# Altium schematic sheet 4 SFP.SchDoc
size 594 x 420 mm; SheetNumber: 5; SheetTotal: 9
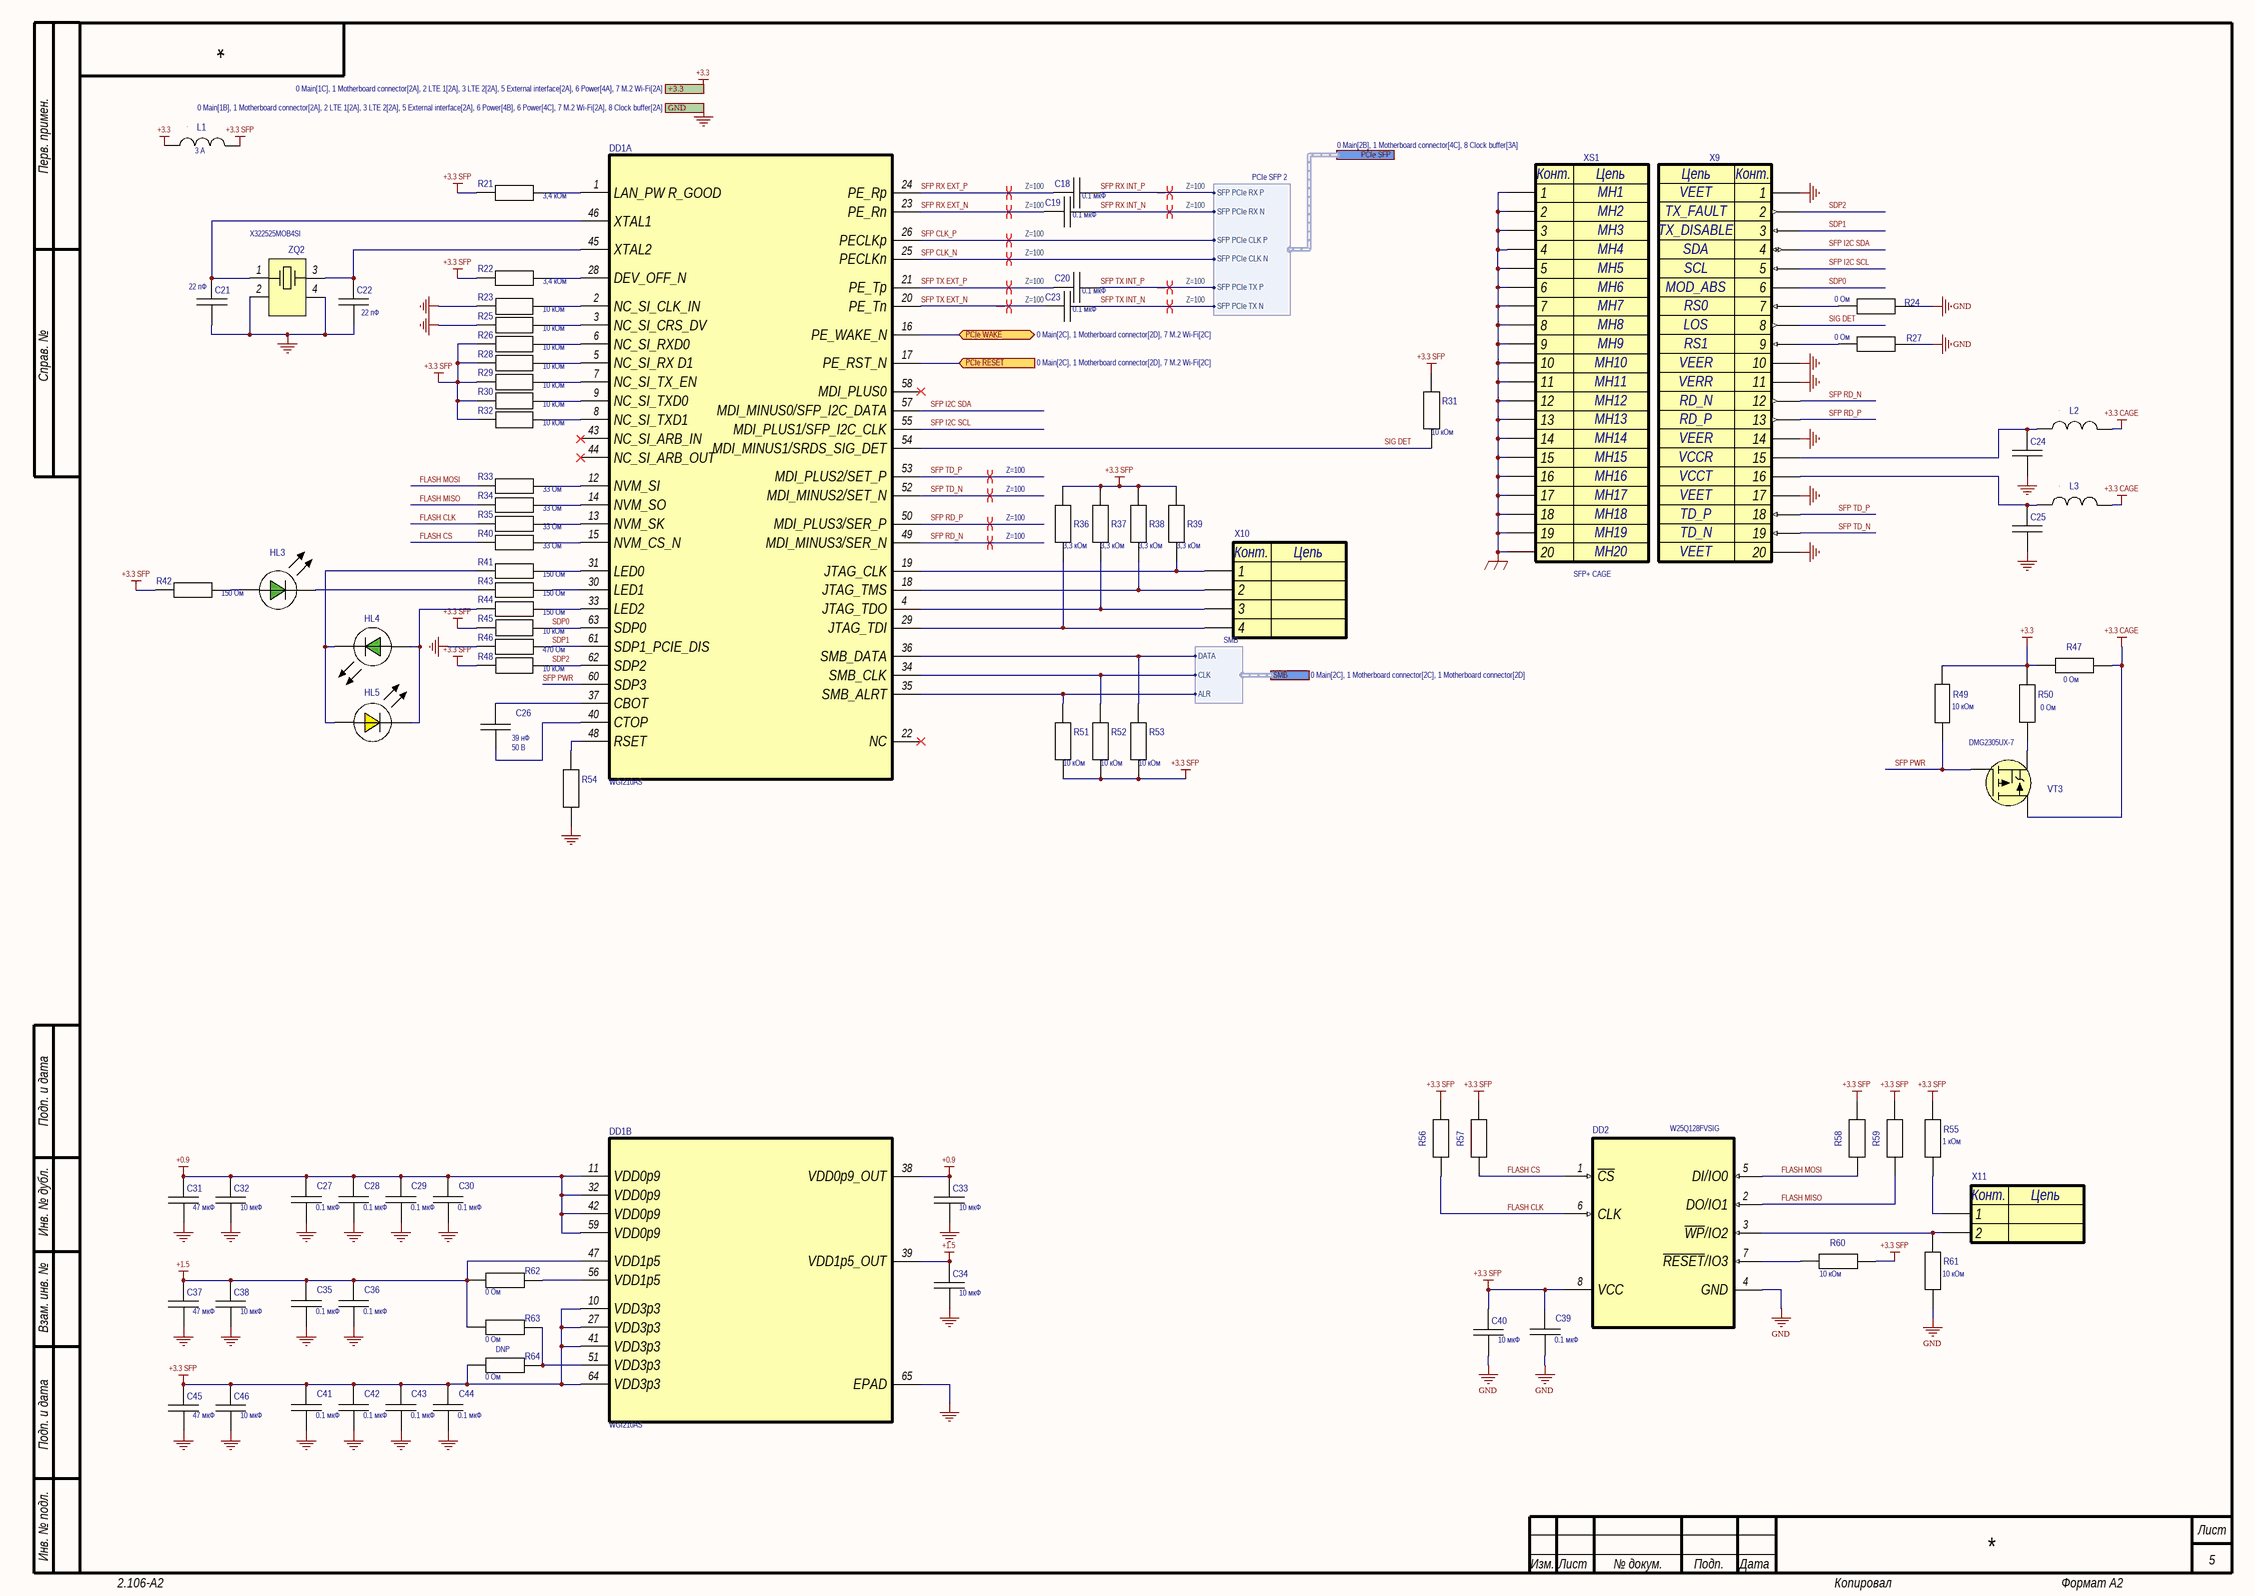
[diagram p0: 4 SFP.SchDoc]

## Parts
C18  value 0.1 мкФ  [CAP_0402]
C19  value 0.1 мкФ  [CAP_0402]
C20  value 0.1 мкФ  [CAP_0402]
C21  value 22 пФ  [CAP_0402]
C22  value 22 пФ  [CAP_0402]
C23  value 0.1 мкФ  [CAP_0402]
C24  (no value)  [CAP_0805]
C25  (no value)  [CAP_0805]
C26  value 39 нФ  Напряжение: 50 В  [CAP_0603]
C27  value 0.1 мкФ  [CAP_0402]
C28  value 0.1 мкФ  [CAP_0402]
C29  value 0.1 мкФ  [CAP_0402]
C30  value 0.1 мкФ  [CAP_0402]
C31  value 47 мкФ  [CAP_0805]
C32  value 10 мкФ  [CAP_0402_BIG]
C33  value 10 мкФ  [CAP_0402_BIG]
C34  value 10 мкФ  [CAP_0402_BIG]
C35  value 0.1 мкФ  [CAP_0402]
C36  value 0.1 мкФ  [CAP_0402]
C37  value 47 мкФ  [CAP_0805]
C38  value 10 мкФ  [CAP_0402_BIG]
C39  value 0.1 мкФ  [CAP_0402]
C40  value 10 мкФ  [CAP_0402_BIG]
C41  value 0.1 мкФ  [CAP_0402]
C42  value 0.1 мкФ  [CAP_0402]
C43  value 0.1 мкФ  [CAP_0402]
C44  value 0.1 мкФ  [CAP_0402]
C45  value 47 мкФ  [CAP_0805]
C46  value 10 мкФ  [CAP_0402_BIG]
DD1  WGI210AS  [QFN64-9X9-P05_WGI210AS]  (parts A,B of 2)
DD2  W25Q128FVSIG  [SOIC-8-208mil]
HL3  155124GS73200  [LED_1204_GREEN]  (value not drawn)
HL4  155124GS73200  [LED_1204_GREEN]  (value not drawn)
HL5  155124YS73200  [LED_1204_YELLOW]  (value not drawn)
L1  Current: 3 А  [IND_0603]  (hidden comment: STD_IND)
L2  STD_IND  [IND_0603]  (value not drawn)
L3  STD_IND  [IND_0603]  (value not drawn)
R21  value 3,4 кОм  [RES_0402]  (hidden comment: STD_RES)
R22  value 3,4 кОм  [RES_0402]  (hidden comment: STD_RES)
R23  value 10 кОм  [RES_0402]  (hidden comment: STD_RES)
R24  value 0 Ом  [RES_0402]  (hidden comment: STD_RES)
R25  value 10 кОм  [RES_0402]  (hidden comment: STD_RES)
R26  value 10 кОм  [RES_0402]  (hidden comment: STD_RES)
R27  value 0 Ом  [RES_0402]  (hidden comment: STD_RES)
R28  value 10 кОм  [RES_0402]  (hidden comment: STD_RES)
R29  value 10 кОм  [RES_0402]  (hidden comment: STD_RES)
R30  value 10 кОм  [RES_0402]  (hidden comment: STD_RES)
R31  value 10 кОм  [RES_0402]  (hidden comment: STD_RES)
R32  value 10 кОм  [RES_0402]  (hidden comment: STD_RES)
R33  value 33 Ом  [RES_0402]  (hidden comment: STD_RES)
R34  value 33 Ом  [RES_0402]  (hidden comment: STD_RES)
R35  value 33 Ом  [RES_0402]  (hidden comment: STD_RES)
R36  value 3,3 кОм  [RES_0402]  (hidden comment: STD_RES)
R37  value 3,3 кОм  [RES_0402]  (hidden comment: STD_RES)
R38  value 3,3 кОм  [RES_0402]  (hidden comment: STD_RES)
R39  value 3,3 кОм  [RES_0402]  (hidden comment: STD_RES)
R40  value 33 Ом  [RES_0402]  (hidden comment: STD_RES)
R41  value 150 Ом  [RES_0402]  (hidden comment: STD_RES)
R42  value 150 Ом  [RES_0402]  (hidden comment: STD_RES)
R43  value 150 Ом  [RES_0402]  (hidden comment: STD_RES)
R44  value 150 Ом  [RES_0402]  (hidden comment: STD_RES)
R45  value 10 кОм  [RES_0402]  (hidden comment: STD_RES)
R46  value 470 Ом  [RES_0402]  (hidden comment: STD_RES)
R47  value 0 Ом  [RES_1206]  (hidden comment: STD_RES)
R48  value 10 кОм  [RES_0402]  (hidden comment: STD_RES)
R49  value 10 кОм  [RES_0402]  (hidden comment: STD_RES)
R50  value 0 Ом  [RES_1206]  (hidden comment: STD_RES)
R51  value 10 кОм  [RES_0402]  (hidden comment: STD_RES)
R52  value 10 кОм  [RES_0402]  (hidden comment: STD_RES)
R53  value 10 кОм  [RES_0402]  (hidden comment: STD_RES)
R54  STD_RES  [RES_0402]  (value not drawn)
R55  value 1 кОм  [RES_0805]  (hidden comment: STD_RES)
R56  STD_RES  [RES_0402]  (value not drawn)
R57  STD_RES  [RES_0402]  (value not drawn)
R58  STD_RES  [RES_0402]  (value not drawn)
R59  STD_RES  [RES_0402]  (value not drawn)
R60  value 10 кОм  [RES_0402]  (hidden comment: STD_RES)
R61  value 10 кОм  [RES_0402]  (hidden comment: STD_RES)
R62  value 0 Ом  [RES_0402]  (hidden comment: STD_RES)
R63  value 0 Ом  [RES_0402]  (hidden comment: STD_RES)
R64  value 0 Ом  [RES_0402]  (hidden comment: STD_RES)
VT3  DMG2305UX-7  [SOT-23-3]
X9  Разъем оптический  [1888247-1]  (value not drawn)
X10  STD_CON4  [PLS-4]  (value not drawn)
X11  STD_CON2  [PLS-2]  (value not drawn)
XS1  SFP+ CAGE  [2007198-1]
ZQ2  X322525MOB4SI  [3.2x2.5_4pin]

## Ports
+3.3 (see 0 Main[1C], 1 Motherboard connector[2A], 2 LTE 1[2A], 3 LTE 2[2A], 5 External interface[2A], 6 Power[4A], 7 M.2 Wi-Fi[2A]), GND (see 0 Main[1B], 1 Motherboard connector[2A], 2 LTE 1[2A], 3 LTE 2[2A], 5 External interface[2A], 6 Power[4B], 6 Power[4C], 7 M.2 Wi-Fi[2A], 8 Clock buffer[2A]), PCIe RESET (in, see 0 Main[2C], 1 Motherboard connector[2D], 7 M.2 Wi-Fi[2C]), PCIe SFP (harness PCIe SFP 2, see 0 Main[2B], 1 Motherboard connector[4C], 8 Clock buffer[3A]), PCIe WAKE (bidir, see 0 Main[2C], 1 Motherboard connector[2D], 7 M.2 Wi-Fi[2C]), SMB (harness SMB, see 0 Main[2C], 1 Motherboard connector[2C], 1 Motherboard connector[2D])

## Harnesses
SMB: DATA, CLK, ALR
PCIe SFP 2: SFP PCIe RX P, SFP PCIe RX N, SFP PCIe CLK P, SFP PCIe CLK N, SFP PCIe TX P, SFP PCIe TX N

## Nets
+0.9: C27.2 C28.2 C29.2 C30.2 C31.1 C32.1 C33.1 DD1.11(VDD0p9) DD1.32(VDD0p9) DD1.38(VDD0p9_OUT) DD1.42(VDD0p9) DD1.59(VDD0p9)
+1.5: C34.1 C35.2 C36.2 C37.1 C38.1 DD1.39(VDD1p5_OUT) DD1.47(VDD1p5) R62.1 R63.1
+3.3: L1.1 R47.1 R49.2 R50.2 ; port +3.3
+3.3 CAGE: L2.2 L3.2 R47.2 VT3.3(D)
+3.3 SFP: C39.2 C40.1 C41.2 C42.2 C43.2 C44.2 C45.1 C46.1 DD1.10(VDD3p3) DD1.27(VDD3p3) DD1.41(VDD3p3) DD1.64(VDD3p3) DD2.8(VCC) L1.2 R21.1 R22.2 R26.1 R28.1 R29.1 R30.1 R31.2 R32.1 R36.2 R37.2 R38.2 R39.2 R42.2 R45.1 R48.1 R51.1 R52.1 R53.1 R55.2 R56.2 R57.2 R58.2 R59.2 R60.2 R64.1
GND: C21.2 C22.2 C24.2 C25.2 C27.1 C28.1 C29.1 C30.1 C31.2 C32.2 C33.2 C34.2 C35.1 C36.1 C37.2 C38.2 C39.1 C40.2 C41.1 C42.1 C43.1 C44.1 C45.2 C46.2 DD1.65(EPAD) DD2.4(GND) R23.1 R24.2 R25.1 R27.2 R46.1 R54.1 R61.1 X9.1 X9.10 X9.11 X9.14 X9.17 X9.20 ZQ2.2 ZQ2.4 ; port GND
GNDG: XS1.1 XS1.2 XS1.3 XS1.4 XS1.5 XS1.6 XS1.7 XS1.8 XS1.9 XS1.10 XS1.11 XS1.12 XS1.13 XS1.14 XS1.15 XS1.16 XS1.17 XS1.18 XS1.19 XS1.20
FLASH CLK: DD2.6(CLK) R35.1 R56.1
FLASH CS: DD2.1(~{CS}) R40.1 R57.1
FLASH MISO: DD2.2(DO/IO1) R34.1 R59.1
FLASH MOSI: DD2.5(DI/IO0) R33.1 R58.1
PCIe RESET: DD1.17(PE_RST_N) ; port PCIe RESET
PCIe WAKE: DD1.16(PE_WAKE_N) ; port PCIe WAKE
SDP0: DD1.63(SDP0) R45.2 X9.6
SDP1: DD1.61(SDP1_PCIE_DIS) R46.2 X9.3
SDP2: DD1.62(SDP2) R48.2 X9.2
SFP CLK_N: DD1.25(PECLKn) ; port PCIe SFP.SFP PCIe CLK N
SFP CLK_P: DD1.26(PECLKp) ; port PCIe SFP.SFP PCIe CLK P
SFP I2C SCL: DD1.55(MDI_PLUS1/SFP_I2C_CLK) X9.5
SFP I2C SDA: DD1.57(MDI_MINUS0/SFP_I2C_DATA) X9.4
SFP PWR: DD1.60(SDP3) R49.1 VT3.1(G)
SFP RD_N: DD1.49(MDI_MINUS3/SER_N) X9.12
SFP RD_P: DD1.50(MDI_PLUS3/SER_P) X9.13
SFP RX EXT_N: C19.1 DD1.23(PE_Rn)
SFP RX EXT_P: C18.1 DD1.24(PE_Rp)
SFP RX INT_N: C19.2 ; port PCIe SFP.SFP PCIe RX N
SFP RX INT_P: C18.2 ; port PCIe SFP.SFP PCIe RX P
SFP TD_N: DD1.52(MDI_MINUS2/SET_N) X9.19
SFP TD_P: DD1.53(MDI_PLUS2/SET_P) X9.18
SFP TX EXT_N: C23.1 DD1.20(PE_Tn)
SFP TX EXT_P: C20.1 DD1.21(PE_Tp)
SFP TX INT_N: C23.2 ; port PCIe SFP.SFP PCIe TX N
SFP TX INT_P: C20.2 ; port PCIe SFP.SFP PCIe TX P
SIG DET: DD1.54(MDI_MINUS1/SRDS_SIG_DET) R31.1 X9.8
NetC21_1: C21.1 DD1.46(XTAL1) ZQ2.1
NetC22_1: C22.1 DD1.45(XTAL2) ZQ2.3
NetC24_1: C24.1 L2.1 X9.15
NetC25_1: C25.1 L3.1 X9.16
NetC26_1: C26.1 DD1.40(CTOP)
NetC26_2: C26.2 DD1.37(CBOT)
NetDD1_1: DD1.1(LAN_PW_R_GOOD) R21.2
NetDD1_2: DD1.2(NC_SI_CLK_IN) R23.2
NetDD1_3: DD1.3(NC_SI_CRS_DV) R25.2
NetDD1_4: DD1.4(JTAG_TDO) R37.1 X10.3
NetDD1_5: DD1.5(NC_SI_RX_D1) R28.2
NetDD1_6: DD1.6(NC_SI_RXD0) R26.2
NetDD1_7: DD1.7(NC_SI_TX_EN) R29.2
NetDD1_8: DD1.8(NC_SI_TXD1) R32.2
NetDD1_9: DD1.9(NC_SI_TXD0) R30.2
NetDD1_12: DD1.12(NVM_SI) R33.2
NetDD1_13: DD1.13(NVM_SK) R35.2
NetDD1_14: DD1.14(NVM_SO) R34.2
NetDD1_15: DD1.15(NVM_CS_N) R40.2
NetDD1_18: DD1.18(JTAG_TMS) R38.1 X10.2
NetDD1_19: DD1.19(JTAG_CLK) R39.1 X10.1
NetDD1_28: DD1.28(DEV_OFF_N) R22.1
NetDD1_29: DD1.29(JTAG_TDI) R36.1 X10.4
NetDD1_30: DD1.30(LED1) R43.1
NetDD1_31: DD1.31(LED0) R41.1
NetDD1_33: DD1.33(LED2) R44.1
NetDD1_34: DD1.34(SMB_CLK) R52.2 ; port SMB.CLK
NetDD1_35: DD1.35(SMB_ALRT) R51.2 ; port SMB.ALR
NetDD1_36: DD1.36(SMB_DATA) R53.2 ; port SMB.DATA
NetDD1_48: DD1.48(RSET) R54.2
NetDD1_51: DD1.51(VDD3p3) R63.2 R64.2
NetDD1_56: DD1.56(VDD1p5) R62.2
NetDD2_3: DD2.3(~{WP}/IO2) R61.2 X11.2
NetDD2_7: DD2.7(~{RESET}/IO3) R60.1
NetHL3_1: HL3.1(A) R42.1
NetHL3_2: HL3.2(K) R43.2
NetHL4_1: HL4.1(A) HL5.2(K) R44.2
NetHL4_2: HL4.2(K) HL5.1(A) R41.2
NetR24_1: R24.1 X9.7
NetR27_1: R27.1 X9.9
NetR50_1: R50.1 VT3.2(S)
NetR55_1: R55.1 X11.1

Not connected (* = marked no-connect by the designer): DD1 22(NC)* 43(NC_SI_ARB_IN)* 44(NC_SI_ARB_OUT)* 58(MDI_PLUS0)*

## Layout directives
differential pair; differential pair class Z=100: SFP CLK_N, SFP CLK_P, SFP RD_N, SFP RD_P, SFP RX EXT_N, SFP RX EXT_P, SFP RX INT_N, SFP RX INT_P, SFP TD_N, SFP TD_P, SFP TX EXT_N, SFP TX EXT_P, SFP TX INT_N, SFP TX INT_P

## Notes on the sheet
- (near R64) DNP
- Перв. примен.
- Справ. №
- Подп. и дата
- Инв. № дубл.
- Взам. инв. №
- Инв. № подл.
- Изм.
- Лист
- № докум.
- Подп.
- Дата
- 2.106-A2
- Копировал
- Формат А2
- (in symbol 1888247-1) Цепь; Конт.; VEET; TX_FAULT; TX_DISABLE; SDA; SCL; MOD_ABS; RS0; LOS; RS1; VEER; VERR; RD_N; RD_P; VCCR; VCCT; TD_P; TD_N
- (in symbol 2007198-1) Конт.; Цепь; MH1; MH2; MH3; MH4; MH5; MH6; MH7; MH8; MH9; MH10; MH11; MH12; MH13; MH14; MH15; MH16; MH17; MH18; MH19; MH20
- (in symbol DS1021-1x4SF11-B (PLS-4)) Конт.; Цепь
- (in symbol PLS-2) Конт.; Цепь

## Library data of the parts
C18-C20 C23 C27-C30 C35 C36 C39 C41-C44 = CC0402KRX7R9BB104: Конденсатор CHIP-0402 0.1 мкФ 50 В 10% X7R; Manufacturer: YAGEO; ID: 357; Напряжение: 50 В; Температура: -55...+85°C; Autor: Admin; PartNumber: CC0402KRX7R9BB104; Type: CHIP-0402; Tolerance: 10%; Диэлектрик: X7R; Data: 10-04-2024
C21 C22 = CC0402JRNPO9BN220: Конденсатор CHIP-0402 22 пФ 50 В 5% NPO; Manufacturer: YAGEO; ID: 24; Напряжение: 50 В; Температура: -55...+85°C; Autor: Admin; PartNumber: CC0402JRNPO9BN220; Type: CHIP-0402; Tolerance: 5%; Диэлектрик: NPO; Data: 08-29-2013
C24 C25 = CC0805KKX7R6BB475: Конденсатор CHIP-0805 4.7 мкФ 10 В 10% X7R; Manufacturer: YAGEO; ID: 150; Value: 4.7 мкФ; Напряжение: 10 В; Температура: -55...+85°C; Autor: Admin; PartNumber: CC0805KKX7R6BB475; Type: CHIP-0805; Tolerance: 10%; Диэлектрик: X7R; Data: 10-21-2015
C26 = CC0603KRX7R9BB393: Конденсатор CHIP-0603 39 нФ 50 В 10% X7R; Manufacturer: YAGEO; ID: 395; Температура: -55...+155°C; Autor: Admin; PartNumber: CC0603KRX7R9BB393; Type: CHIP-0603; Tolerance: 10%; Диэлектрик: X7R; Data: 08-26-2025
C31 C37 C45 = GRM21BR60J476ME15L: Конденсатор CHIP-0805 47 мкФ 6.3 В 20% X5R; Manufacturer: MURATA; ID: 268; Напряжение: 6.3 В; Температура: -55...+85°C; Autor: Admin; PartNumber: GRM21BR60J476ME15L; Type: CHIP-0805; Tolerance: 20%; Диэлектрик: X5R; Data: 11-23-2018
C32-C34 C38 C40 C46 = CC0402MRX5R5BB106: Конденсатор CHIP-0402 10 мкФ 6.3 В 20% X5R; Manufacturer: YAGEO; ID: 340; Напряжение: 6.3 В; Температура: -55...+85°C; Autor: Admin; PartNumber: CC0402MRX5R5BB106; Type: CHIP-0402; Tolerance: 20%; Диэлектрик: X5R; Data: 02-12-2025
DD1 = WGI210AS: Микросхема Intel  Ethernet Controller  PCIe v2.1 (2.5 GT/s) x1; ID: 848; Voltage: 3.3 В; Current: 100 мА; Температура: -40...+85°C; Autor: Admin; PartNumber: WGI210AS; Type: Interfaces; Value: Ethernet Controller  PCIe v2.1 (2.5 GT/s) x1; Manufacturer: Intel; Data: 08-25-2025
DD2 = W25Q128FVSIG: Микросхема Winbond  3V 128M-BIT / SERIAL FLASH MEMORY WITH / DUAL/QUAD SPI & QPI; ID: 780; Voltage: 2.7-3.3В; Current: 4 мА; Температура: -40...+85°C; Autor: Admin; Component Type: Микросхема; PartNumber: W25Q128FVSIG; Type: Memory; Value: 3V 128M-BIT / SERIAL FLASH MEMORY WITH / DUAL/QUAD SPI & QPI; Manufacturer: Winbond; Data: 10-08-2024
HL3 HL4 = 155124GS73200: Диод Wurth 2 В 25 мА; ID: 118; Type: LED; U_direct: 2 В; U_reverse: 5 В; Current: 25 мА; Температура: -40...+85°C; Autor: Admin; PartNumber: 155124GS73200; Manufacturer: Wurth; Data: 04-03-2020
HL5 = 155124YS73200: Диод Wurth 2 В 25 мА; ID: 120; Type: LED; U_direct: 2 В; U_reverse: 5 В; Current: 25 мА; Температура: -40...+85°C; Autor: Admin; PartNumber: 155124YS73200; Manufacturer: Wurth; Data: 04-03-2020
L1 = BLM18PG330SN1D: Катушка индуктивности BEAD-0603 33 Ом @100 МГц 25%; Manufacturer: MURATA; ID: 257; Температура: -40...+85°C; Autor: Admin; PartNumber: BLM18PG330SN1D; Type: BEAD-0603; Value: 33 Ом @100 МГц; Tolerance: 25%; Data: 08-26-2025
L2 L3 = MLF1608A3R3KTA00: Катушка индуктивности CHIP-0603 3.3 мкГн 10%; Manufacturer: TDK; ID: 209; Current: 30 мА; Температура: -40...+85°C; Autor: Admin; PartNumber: MLF1608A3R3KTA00; Type: CHIP-0603; Value: 3.3 мкГн; Tolerance: 10%; Data: 09-12-2019
R21 R22 = RC0402FR-073K4L: Резистор CHIP-0402 3,4 кОм 1%; Manufacturer: YAGEO; ID: 368; ТКС: 100 ppm/K; Температура: -55...+155°C; Autor: Цислав А.Н.; PartNumber: RC0402FR-073K4L; Type: CHIP-0402; Tolerance: 1%; Data: 02-03-2014
R23 R25 R26 R28-R30 R32 R45 R48 R49 = RC0402FR-0710KL: Резистор CHIP-0402 10 кОм 1%; Manufacturer: YAGEO; ID: 412; ТКС: 100 ppm/K; Температура: -55...+155°C; Autor: Цислав А.Н.; PartNumber: RC0402FR-0710KL; Type: CHIP-0402; Tolerance: 1%; Data: 02-03-2014
R24 R27 R62-R64 = RC0402JR-070RL: Резистор CHIP-0402 0 Ом 5%; Manufacturer: YAGEO; ID: 236; ТКС: 100 ppm/K; Температура: -55...+85°C; Autor: Admin; PartNumber: RC0402JR-070RL; Type: CHIP-0402; Tolerance: 5%; Data: 04-22-2025
R31 R51-R53 R60 R61 = RC0402JR-0710KL: Резистор CHIP-0402 10 кОм 5%; Manufacturer: YAGEO; ID: 413; ТКС: 100 ppm/K; Температура: -55...+155°C; Autor: Цислав А.Н.; PartNumber: RC0402JR-0710KL; Type: CHIP-0402; Tolerance: 5%; Data: 02-03-2014
R33-R35 R40 = RC0402FR-0733RL: Резистор CHIP-0402 33 Ом 1%; Manufacturer: YAGEO; ID: 278; ТКС: 100 ppm/K; Температура: -55...+155°C; Autor: Цислав А.Н.; PartNumber: RC0402FR-0733RL; Type: CHIP-0402; Tolerance: 1%; Data: 02-03-2014
R36-R39 = RC0402JR-073K3L: Резистор CHIP-0402 3,3 кОм 5%; Manufacturer: YAGEO; ID: 367; ТКС: 100 ppm/K; Температура: -55...+155°C; Autor: Цислав А.Н.; PartNumber: RC0402JR-073K3L; Type: CHIP-0402; Tolerance: 5%; Data: 02-03-2014
R41-R44 = RC0402JR-07150RL: Резистор CHIP-0402 150 Ом 5%; Manufacturer: YAGEO; ID: 306; ТКС: 100 ppm/K; Температура: -55...+155°C; Autor: Цислав А.Н.; PartNumber: RC0402JR-07150RL; Type: CHIP-0402; Tolerance: 5%; Data: 02-03-2014
R46 = RC0402JR-07470RL: Резистор CHIP-0402 470 Ом 5%; Manufacturer: YAGEO; ID: 326; ТКС: 100 ppm/K; Температура: -55...+155°C; Autor: Цислав А.Н.; PartNumber: RC0402JR-07470RL; Type: CHIP-0402; Tolerance: 5%; Data: 02-03-2014
R47 R50 = RC1206JR-070RL: Резистор CHIP-1206 0 Ом 5%; Manufacturer: YAGEO; ID: 239; ТКС: 100 ppm/K; Температура: -55...+85°C; Autor: Admin; PartNumber: RC1206JR-070RL; Type: CHIP-1206; Tolerance: 5%; Data: 04-22-2025
R54 R56-R59 = RC0402JR-074K7L: Резистор CHIP-0402 4,7 кОм 5%; Manufacturer: YAGEO; ID: 382; Value: 4,7 кОм; ТКС: 100 ppm/K; Температура: -55...+155°C; Autor: Цислав А.Н.; PartNumber: RC0402JR-074K7L; Type: CHIP-0402; Tolerance: 5%; Data: 02-03-2014
R55 = RC0805JR-071KL: Резистор CHIP-0805 1 кОм 5%; Manufacturer: YAGEO; ID: 504; ТКС: 100 ppm/K; Температура: -55...+155°C; Autor: Admin; PartNumber: RC0805JR-071KL; Type: CHIP-0805; Tolerance: 5%; Data: 01-29-2016
VT3 = DMG2305UX-7: Микросхема Diode Inc MOSFET P-Channel 20V 4.2A; ID: 721; Voltage: 20 В; Current: 4.2 А; Температура: -40...+85°C; Autor: Admin; PartNumber: DMG2305UX-7; Type: MOSFET P-Channel; Value: MOSFET P-Channel 20V 4.2A; Manufacturer: Diode Inc; Data: 10-30-2023
X9 = 1888247-1: Разъем TE SFP; ID: 422; Contact: 20; Pitch: 0.4 мм; Current: 1 А; Autor: Admin; Component Type: Разъём; PartNumber: 1888247-1; Type: SFP; Mounting: Поверхностный; Manufacturer: TE; Data: 11-07-2024
X10 = DS1021-1x4SF11-B (PLS-4): Разъем Connfly PLS; ID: 439; Contact: 4; Pitch: 2.54 мм; Current: 1 А; Autor: Admin; PartNumber: DS1021-1x4SF11-B (PLS-4); Type: PLS; Mounting: Сквозной; Manufacturer: Connfly; Data: 01-10-2025
X11 = PLS-2: Разъем NoName PLS; ID: 2; Pitch: 2.54 мм; Current: 2 А; Autor: Admin; PartNumber: PLS-2; Type: PLS; Contact: 2; Mounting: Сквозной; Manufacturer: NoName; Data: 09-04-2013
XS1 = 2007198-1: Разъем TE SFP; ID: 424; Contact: 20; Current: 1 А; Autor: Admin; Component Type: Разъём; PartNumber: 2007198-1; Type: SFP; Pitch: -; Mounting: Сквозной; Manufacturer: TE; Data: 11-08-2024
ZQ2 = X322525MOB4SI: Микросхема YXC  Quartz Cristal 25 MHz ±20ppm; ID: 824; Value: Quartz Crуstal 25 MHz ±20ppm; Температура: -40...+85°C; Autor: Admin; PartNumber: X322525MOB4SI; Type: Clocks; Voltage: -; Current: -; Manufacturer: YXC; Data: 12-10-2024